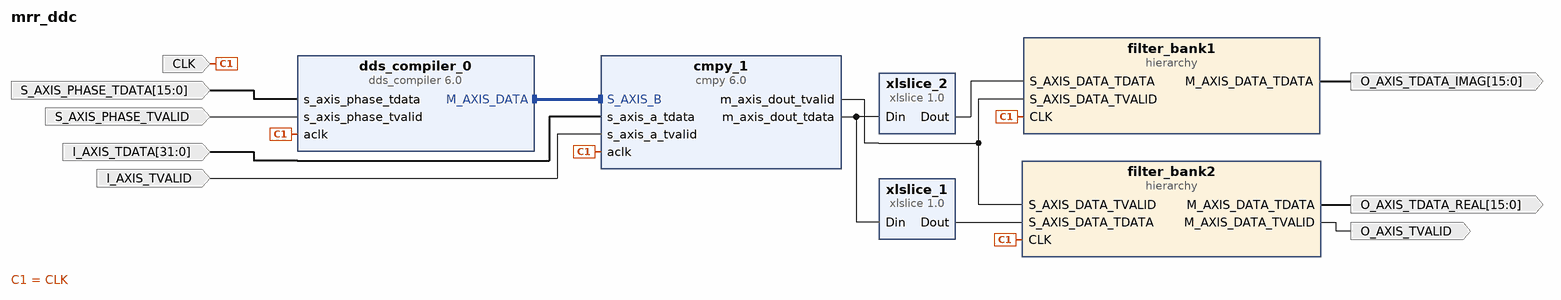
[diagram p0: block diagram of the top level]
# Vivado block design mrr_ddc, xc7a35tftg256-1, Vivado 2024.1
create_bd_design mrr_ddc

create_bd_port -dir I -type clk CLK
set_property -dict {CONFIG.FREQ_HZ 120000000} [get_bd_ports CLK]
create_bd_port -dir I I_AXIS_TVALID
create_bd_port -dir O O_AXIS_TVALID
create_bd_port -dir I -from 31 -to 0 -type data I_AXIS_TDATA
create_bd_port -dir O -from 15 -to 0 -type data O_AXIS_TDATA_REAL
create_bd_port -dir O -from 15 -to 0 -type data O_AXIS_TDATA_IMAG
create_bd_port -dir I -from 15 -to 0 -type data S_AXIS_PHASE_TDATA
create_bd_port -dir I S_AXIS_PHASE_TVALID

create_bd_cell -type ip -vlnv xilinx.com:ip:cmpy:6.0 cmpy_1
set_property -dict {CONFIG.APortWidth 14 CONFIG.BPortWidth 14 CONFIG.OutputWidth 18} [get_bd_cells cmpy_1]
create_bd_cell -type ip -vlnv xilinx.com:ip:dds_compiler:6.0 dds_compiler_0
set_property -dict [list \
  CONFIG.DATA_Has_TLAST Not_Required \
  CONFIG.DDS_Clock_Rate 100 \
  CONFIG.Frequency_Resolution 0.4 \
  CONFIG.Has_Phase_Out false \
  CONFIG.Latency 6 \
  CONFIG.M_DATA_Has_TUSER Not_Required \
  CONFIG.Noise_Shaping None \
  CONFIG.Output_Frequency1 0 \
  CONFIG.Output_Width 14 \
  CONFIG.PINC1 0 \
  CONFIG.Parameter_Entry Hardware_Parameters \
  CONFIG.PartsPresent SIN_COS_LUT_only \
  CONFIG.Phase_Increment Fixed \
  CONFIG.Phase_Width 16 \
  CONFIG.S_PHASE_Has_TUSER Not_Required \
] [get_bd_cells dds_compiler_0]
create_bd_cell -type ip -vlnv xilinx.com:ip:xlslice:1.0 xlslice_1
set_property -dict {CONFIG.DIN_FROM 15 CONFIG.DIN_WIDTH 48 CONFIG.DOUT_WIDTH 16} [get_bd_cells xlslice_1]
create_bd_cell -type ip -vlnv xilinx.com:ip:xlslice:1.0 xlslice_2
set_property -dict {CONFIG.DIN_FROM 39 CONFIG.DIN_TO 24 CONFIG.DIN_WIDTH 48 CONFIG.DOUT_WIDTH 16} [get_bd_cells xlslice_2]
create_bd_cell -type hier filter_bank1
create_bd_cell -type hier filter_bank2

# ---- hierarchy /filter_bank1 ----
current_bd_instance /filter_bank1
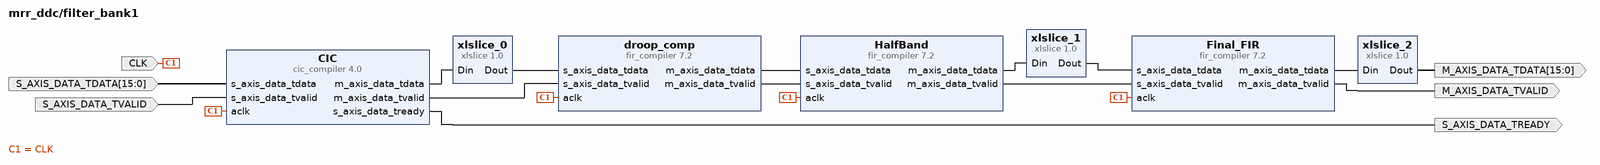
[diagram p1: block diagram inside /filter_bank1]
create_bd_pin -dir I -type clk CLK
create_bd_pin -dir I -from 15 -to 0 S_AXIS_DATA_TDATA
create_bd_pin -dir O S_AXIS_DATA_TREADY
create_bd_pin -dir I S_AXIS_DATA_TVALID
create_bd_pin -dir O -from 15 -to 0 M_AXIS_DATA_TDATA
create_bd_pin -dir O M_AXIS_DATA_TVALID

create_bd_cell -type ip -vlnv xilinx.com:ip:cic_compiler:4.0 CIC
set_property -dict [list \
  CONFIG.Clock_Frequency 120 \
  CONFIG.Filter_Type Decimation \
  CONFIG.Fixed_Or_Initial_Rate 30 \
  CONFIG.Input_Data_Width 16 \
  CONFIG.Input_Sample_Frequency 120 \
  CONFIG.Maximum_Rate 30 \
  CONFIG.Minimum_Rate 30 \
  CONFIG.Number_Of_Stages 6 \
  CONFIG.Output_Data_Width 18 \
  CONFIG.Passband_Max 0.1 \
  CONFIG.Passband_Min 0 \
  CONFIG.Quantization Truncation \
  CONFIG.Response_Magnitude Output_Quantization \
  CONFIG.SamplePeriod 1 \
] [get_bd_cells CIC]
create_bd_cell -type ip -vlnv xilinx.com:ip:fir_compiler:7.2 HalfBand
set_property -dict [list \
  CONFIG.Clock_Frequency 120 \
  CONFIG.CoefficientVector {-4413,0,37165,65536,37165,0, -4413} \
  CONFIG.Coefficient_Fractional_Bits 0 \
  CONFIG.Coefficient_Sets 1 \
  CONFIG.Coefficient_Sign Signed \
  CONFIG.Coefficient_Structure Inferred \
  CONFIG.Coefficient_Width 18 \
  CONFIG.Data_Width 24 \
  CONFIG.Decimation_Rate 2 \
  CONFIG.Filter_Architecture Systolic_Multiply_Accumulate \
  CONFIG.Filter_Type Decimation \
  CONFIG.Interpolation_Rate 1 \
  CONFIG.Number_Channels 1 \
  CONFIG.Output_Rounding_Mode Truncate_LSBs \
  CONFIG.Output_Width 18 \
  CONFIG.Quantization Integer_Coefficients \
  CONFIG.RateSpecification Frequency_Specification \
  CONFIG.Sample_Frequency 2 \
  CONFIG.Zero_Pack_Factor 1 \
] [get_bd_cells HalfBand]
create_bd_cell -type ip -vlnv xilinx.com:ip:fir_compiler:7.2 Final_FIR
set_property -dict [list \
  CONFIG.Clock_Frequency 120 \
  CONFIG.CoefficientVector 17,11,10,4,-6,-18,-30,-37,-37,-29,-12,8,27,39,38,24,-1,-30,-54,-65,-56,-28,12,54,83,90,68,21,-38,-93,-124,-120,-76,-3,80,147,175,150,73,-36,-146,-222,-236,-175,-50,105,245,323,306,188,-6,-224,-397,-464,-390,-177,125,434,650,687,503,115,-394,-885,-1196,-1178,-737,136,1357,2753,4099,5160,5744,5744,5160,4099,2753,1357,136,-737,-1178,-1196,-885,-394,115,503,687,650,434,125,-177,-390,-464,-397,-224,-6,188,306,323,245,105,-50,-175,-236,-222,-146,-36,73,150,175,147,80,-3,-76,-120,-124,-93,-38,21,68,90,83,54,12,-28,-56,-65,-54,-30,-1,24,38,39,27,8,-12,-29,-37,-37,-30,-18,-6,4,10,11,17 \
  CONFIG.Coefficient_Fractional_Bits 0 \
  CONFIG.Coefficient_Sets 1 \
  CONFIG.Coefficient_Sign Signed \
  CONFIG.Coefficient_Structure Inferred \
  CONFIG.Coefficient_Width 18 \
  CONFIG.Data_Width 16 \
  CONFIG.Decimation_Rate 10 \
  CONFIG.Filter_Architecture Systolic_Multiply_Accumulate \
  CONFIG.Filter_Type Decimation \
  CONFIG.Interpolation_Rate 1 \
  CONFIG.Number_Channels 1 \
  CONFIG.Output_Rounding_Mode Truncate_LSBs \
  CONFIG.Output_Width 17 \
  CONFIG.Quantization Integer_Coefficients \
  CONFIG.RateSpecification Frequency_Specification \
  CONFIG.Sample_Frequency 1 \
  CONFIG.Zero_Pack_Factor 1 \
] [get_bd_cells Final_FIR]
create_bd_cell -type ip -vlnv xilinx.com:ip:fir_compiler:7.2 droop_comp
set_property -dict [list \
  CONFIG.Clock_Frequency 120 \
  CONFIG.Coefficient_Structure Inferred \
  CONFIG.Coefficient_Width 16 \
  CONFIG.ColumnConfig 1 \
  CONFIG.Data_Width 16 \
  CONFIG.Decimation_Rate 2 \
  CONFIG.Filter_Architecture Systolic_Multiply_Accumulate \
  CONFIG.Filter_Type Decimation \
  CONFIG.Interpolation_Rate 1 \
  CONFIG.Number_Channels 1 \
  CONFIG.Output_Rounding_Mode Full_Precision \
  CONFIG.Output_Width 24 \
  CONFIG.RateSpecification Frequency_Specification \
  CONFIG.Sample_Frequency 4 \
  CONFIG.Zero_Pack_Factor 1 \
] [get_bd_cells droop_comp]
create_bd_cell -type ip -vlnv xilinx.com:ip:xlslice:1.0 xlslice_0
set_property -dict {CONFIG.DIN_FROM 15 CONFIG.DIN_WIDTH 24} [get_bd_cells xlslice_0]
create_bd_cell -type ip -vlnv xilinx.com:ip:xlslice:1.0 xlslice_1
set_property -dict {CONFIG.DIN_FROM 15 CONFIG.DIN_WIDTH 24} [get_bd_cells xlslice_1]
create_bd_cell -type ip -vlnv xilinx.com:ip:xlslice:1.0 xlslice_2
set_property -dict {CONFIG.DIN_FROM 15 CONFIG.DIN_WIDTH 24} [get_bd_cells xlslice_2]

# ---- hierarchy /filter_bank2 ----
current_bd_instance /filter_bank2
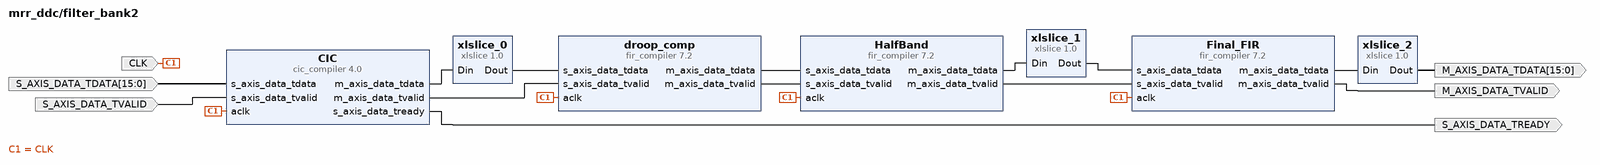
[diagram p2: block diagram inside /filter_bank2]
create_bd_pin -dir I -type clk CLK
create_bd_pin -dir I -from 15 -to 0 S_AXIS_DATA_TDATA
create_bd_pin -dir O S_AXIS_DATA_TREADY
create_bd_pin -dir I S_AXIS_DATA_TVALID
create_bd_pin -dir O -from 15 -to 0 M_AXIS_DATA_TDATA
create_bd_pin -dir O M_AXIS_DATA_TVALID

create_bd_cell -type ip -vlnv xilinx.com:ip:cic_compiler:4.0 CIC
set_property -dict [list \
  CONFIG.Clock_Frequency 120 \
  CONFIG.Filter_Type Decimation \
  CONFIG.Fixed_Or_Initial_Rate 30 \
  CONFIG.Input_Data_Width 16 \
  CONFIG.Input_Sample_Frequency 120 \
  CONFIG.Maximum_Rate 30 \
  CONFIG.Minimum_Rate 30 \
  CONFIG.Number_Of_Stages 6 \
  CONFIG.Output_Data_Width 18 \
  CONFIG.Passband_Max 0.1 \
  CONFIG.Passband_Min 0 \
  CONFIG.Quantization Truncation \
  CONFIG.Response_Magnitude Output_Quantization \
  CONFIG.SamplePeriod 1 \
] [get_bd_cells CIC]
create_bd_cell -type ip -vlnv xilinx.com:ip:fir_compiler:7.2 HalfBand
set_property -dict [list \
  CONFIG.Clock_Frequency 120 \
  CONFIG.CoefficientVector {-4413,0,37165,65536,37165,0, -4413} \
  CONFIG.Coefficient_Fractional_Bits 0 \
  CONFIG.Coefficient_Sets 1 \
  CONFIG.Coefficient_Sign Signed \
  CONFIG.Coefficient_Structure Inferred \
  CONFIG.Coefficient_Width 18 \
  CONFIG.Data_Width 24 \
  CONFIG.Decimation_Rate 2 \
  CONFIG.Filter_Architecture Systolic_Multiply_Accumulate \
  CONFIG.Filter_Type Decimation \
  CONFIG.Interpolation_Rate 1 \
  CONFIG.Number_Channels 1 \
  CONFIG.Output_Rounding_Mode Truncate_LSBs \
  CONFIG.Output_Width 18 \
  CONFIG.Quantization Integer_Coefficients \
  CONFIG.RateSpecification Frequency_Specification \
  CONFIG.Sample_Frequency 2 \
  CONFIG.Zero_Pack_Factor 1 \
] [get_bd_cells HalfBand]
create_bd_cell -type ip -vlnv xilinx.com:ip:fir_compiler:7.2 Final_FIR
set_property -dict [list \
  CONFIG.Clock_Frequency 120 \
  CONFIG.CoefficientVector 17,11,10,4,-6,-18,-30,-37,-37,-29,-12,8,27,39,38,24,-1,-30,-54,-65,-56,-28,12,54,83,90,68,21,-38,-93,-124,-120,-76,-3,80,147,175,150,73,-36,-146,-222,-236,-175,-50,105,245,323,306,188,-6,-224,-397,-464,-390,-177,125,434,650,687,503,115,-394,-885,-1196,-1178,-737,136,1357,2753,4099,5160,5744,5744,5160,4099,2753,1357,136,-737,-1178,-1196,-885,-394,115,503,687,650,434,125,-177,-390,-464,-397,-224,-6,188,306,323,245,105,-50,-175,-236,-222,-146,-36,73,150,175,147,80,-3,-76,-120,-124,-93,-38,21,68,90,83,54,12,-28,-56,-65,-54,-30,-1,24,38,39,27,8,-12,-29,-37,-37,-30,-18,-6,4,10,11,17 \
  CONFIG.Coefficient_Fractional_Bits 0 \
  CONFIG.Coefficient_Sets 1 \
  CONFIG.Coefficient_Sign Signed \
  CONFIG.Coefficient_Structure Inferred \
  CONFIG.Coefficient_Width 18 \
  CONFIG.Data_Width 16 \
  CONFIG.Decimation_Rate 10 \
  CONFIG.Filter_Architecture Systolic_Multiply_Accumulate \
  CONFIG.Filter_Type Decimation \
  CONFIG.Interpolation_Rate 1 \
  CONFIG.Number_Channels 1 \
  CONFIG.Output_Rounding_Mode Truncate_LSBs \
  CONFIG.Output_Width 17 \
  CONFIG.Quantization Integer_Coefficients \
  CONFIG.RateSpecification Frequency_Specification \
  CONFIG.Sample_Frequency 1 \
  CONFIG.Zero_Pack_Factor 1 \
] [get_bd_cells Final_FIR]
create_bd_cell -type ip -vlnv xilinx.com:ip:fir_compiler:7.2 droop_comp
set_property -dict [list \
  CONFIG.Clock_Frequency 120 \
  CONFIG.Coefficient_Structure Inferred \
  CONFIG.Coefficient_Width 16 \
  CONFIG.ColumnConfig 1 \
  CONFIG.Data_Width 16 \
  CONFIG.Decimation_Rate 2 \
  CONFIG.Filter_Architecture Systolic_Multiply_Accumulate \
  CONFIG.Filter_Type Decimation \
  CONFIG.Interpolation_Rate 1 \
  CONFIG.Number_Channels 1 \
  CONFIG.Output_Rounding_Mode Full_Precision \
  CONFIG.Output_Width 24 \
  CONFIG.RateSpecification Frequency_Specification \
  CONFIG.Sample_Frequency 4 \
  CONFIG.Zero_Pack_Factor 1 \
] [get_bd_cells droop_comp]
create_bd_cell -type ip -vlnv xilinx.com:ip:xlslice:1.0 xlslice_0
set_property -dict {CONFIG.DIN_FROM 15 CONFIG.DIN_WIDTH 24} [get_bd_cells xlslice_0]
create_bd_cell -type ip -vlnv xilinx.com:ip:xlslice:1.0 xlslice_1
set_property -dict {CONFIG.DIN_FROM 15 CONFIG.DIN_WIDTH 24} [get_bd_cells xlslice_1]
create_bd_cell -type ip -vlnv xilinx.com:ip:xlslice:1.0 xlslice_2
set_property -dict {CONFIG.DIN_FROM 15 CONFIG.DIN_WIDTH 24} [get_bd_cells xlslice_2]

# ---- connections ----

current_bd_instance /filter_bank1
connect_bd_net [get_bd_pins CIC/m_axis_data_tdata] [get_bd_pins xlslice_0/Din]
connect_bd_net [get_bd_pins CIC/m_axis_data_tvalid] [get_bd_pins droop_comp/s_axis_data_tvalid]
connect_bd_net [get_bd_pins CIC/s_axis_data_tready] [get_bd_pins S_AXIS_DATA_TREADY]
connect_bd_net [get_bd_pins CLK] [get_bd_pins CIC/aclk] [get_bd_pins Final_FIR/aclk] [get_bd_pins HalfBand/aclk] [get_bd_pins droop_comp/aclk]
connect_bd_net [get_bd_pins Final_FIR/m_axis_data_tdata] [get_bd_pins xlslice_2/Din]
connect_bd_net [get_bd_pins Final_FIR/m_axis_data_tvalid] [get_bd_pins M_AXIS_DATA_TVALID]
connect_bd_net [get_bd_pins HalfBand/m_axis_data_tdata] [get_bd_pins xlslice_1/Din]
connect_bd_net [get_bd_pins HalfBand/m_axis_data_tvalid] [get_bd_pins Final_FIR/s_axis_data_tvalid]
connect_bd_net [get_bd_pins S_AXIS_DATA_TDATA] [get_bd_pins CIC/s_axis_data_tdata]
connect_bd_net [get_bd_pins S_AXIS_DATA_TVALID] [get_bd_pins CIC/s_axis_data_tvalid]
connect_bd_net [get_bd_pins droop_comp/m_axis_data_tdata] [get_bd_pins HalfBand/s_axis_data_tdata]
connect_bd_net [get_bd_pins droop_comp/m_axis_data_tvalid] [get_bd_pins HalfBand/s_axis_data_tvalid]
connect_bd_net [get_bd_pins xlslice_0/Dout] [get_bd_pins droop_comp/s_axis_data_tdata]
connect_bd_net [get_bd_pins xlslice_1/Dout] [get_bd_pins Final_FIR/s_axis_data_tdata]
connect_bd_net [get_bd_pins xlslice_2/Dout] [get_bd_pins M_AXIS_DATA_TDATA]

current_bd_instance /filter_bank2
connect_bd_net [get_bd_pins CIC/m_axis_data_tdata] [get_bd_pins xlslice_0/Din]
connect_bd_net [get_bd_pins CIC/m_axis_data_tvalid] [get_bd_pins droop_comp/s_axis_data_tvalid]
connect_bd_net [get_bd_pins CIC/s_axis_data_tready] [get_bd_pins S_AXIS_DATA_TREADY]
connect_bd_net [get_bd_pins CLK] [get_bd_pins CIC/aclk] [get_bd_pins Final_FIR/aclk] [get_bd_pins HalfBand/aclk] [get_bd_pins droop_comp/aclk]
connect_bd_net [get_bd_pins Final_FIR/m_axis_data_tdata] [get_bd_pins xlslice_2/Din]
connect_bd_net [get_bd_pins Final_FIR/m_axis_data_tvalid] [get_bd_pins M_AXIS_DATA_TVALID]
connect_bd_net [get_bd_pins HalfBand/m_axis_data_tdata] [get_bd_pins xlslice_1/Din]
connect_bd_net [get_bd_pins HalfBand/m_axis_data_tvalid] [get_bd_pins Final_FIR/s_axis_data_tvalid]
connect_bd_net [get_bd_pins S_AXIS_DATA_TDATA] [get_bd_pins CIC/s_axis_data_tdata]
connect_bd_net [get_bd_pins S_AXIS_DATA_TVALID] [get_bd_pins CIC/s_axis_data_tvalid]
connect_bd_net [get_bd_pins droop_comp/m_axis_data_tdata] [get_bd_pins HalfBand/s_axis_data_tdata]
connect_bd_net [get_bd_pins droop_comp/m_axis_data_tvalid] [get_bd_pins HalfBand/s_axis_data_tvalid]
connect_bd_net [get_bd_pins xlslice_0/Dout] [get_bd_pins droop_comp/s_axis_data_tdata]
connect_bd_net [get_bd_pins xlslice_1/Dout] [get_bd_pins Final_FIR/s_axis_data_tdata]
connect_bd_net [get_bd_pins xlslice_2/Dout] [get_bd_pins M_AXIS_DATA_TDATA]

current_bd_instance /
connect_bd_intf_net [get_bd_intf_pins dds_compiler_0/M_AXIS_DATA] [get_bd_intf_pins cmpy_1/S_AXIS_B]
connect_bd_net [get_bd_ports CLK] \
  [get_bd_pins filter_bank1/CLK] [get_bd_pins cmpy_1/aclk] [get_bd_pins dds_compiler_0/aclk] [get_bd_pins filter_bank2/CLK]
connect_bd_net [get_bd_ports I_AXIS_TDATA] [get_bd_pins cmpy_1/s_axis_a_tdata]
connect_bd_net [get_bd_ports I_AXIS_TVALID] [get_bd_pins cmpy_1/s_axis_a_tvalid]
connect_bd_net -net S_AXIS_DATA_TDATA_1 [get_bd_pins xlslice_2/Dout] [get_bd_pins filter_bank1/S_AXIS_DATA_TDATA]
connect_bd_net [get_bd_ports S_AXIS_PHASE_TDATA] [get_bd_pins dds_compiler_0/s_axis_phase_tdata]
connect_bd_net [get_bd_ports S_AXIS_PHASE_TVALID] [get_bd_pins dds_compiler_0/s_axis_phase_tvalid]
connect_bd_net [get_bd_pins cmpy_1/m_axis_dout_tdata] [get_bd_pins xlslice_1/Din] [get_bd_pins xlslice_2/Din]
connect_bd_net [get_bd_pins cmpy_1/m_axis_dout_tvalid] [get_bd_pins filter_bank1/S_AXIS_DATA_TVALID] [get_bd_pins filter_bank2/S_AXIS_DATA_TVALID]
connect_bd_net [get_bd_pins filter_bank1/M_AXIS_DATA_TDATA] [get_bd_ports O_AXIS_TDATA_IMAG]
connect_bd_net [get_bd_pins filter_bank2/M_AXIS_DATA_TDATA] [get_bd_ports O_AXIS_TDATA_REAL]
connect_bd_net [get_bd_pins filter_bank2/M_AXIS_DATA_TVALID] [get_bd_ports O_AXIS_TVALID]
connect_bd_net [get_bd_pins xlslice_1/Dout] [get_bd_pins filter_bank2/S_AXIS_DATA_TDATA]

validate_bd_design
save_bd_design
